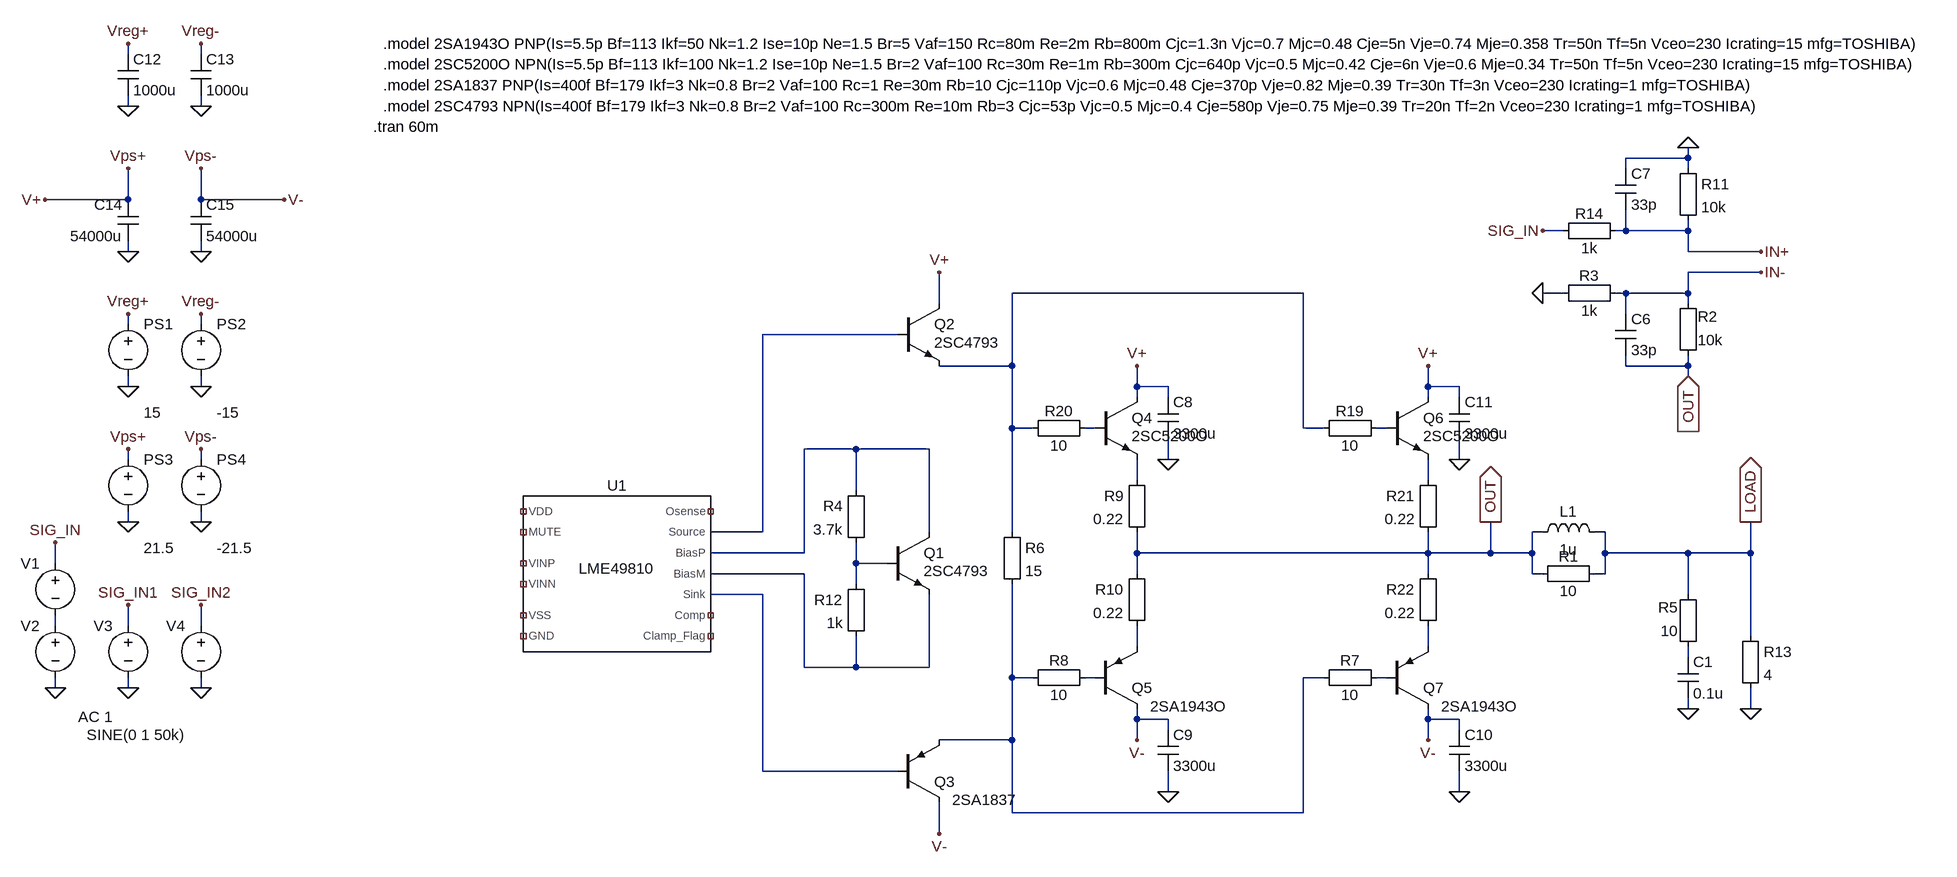
[diagram p0: schematic LME49810.asc]
LME49810.asc, the LTspice schematic file:
Version 4
SHEET 1 5860 2324
WIRE -1152 -3136 -1152 -3152
WIRE -1040 -3136 -1040 -3152
WIRE -1152 -3056 -1152 -3072
WIRE -1040 -3056 -1040 -3072
WIRE 1248 -2976 1248 -2992
WIRE 1248 -2976 1152 -2976
WIRE 1152 -2960 1152 -2976
WIRE 1248 -2960 1248 -2976
WIRE -1152 -2912 -1152 -2960
WIRE -1152 -2912 -1280 -2912
WIRE -1040 -2912 -1040 -2960
WIRE -912 -2912 -1040 -2912
WIRE 1056 -2864 1024 -2864
WIRE 1152 -2864 1152 -2896
WIRE 1152 -2864 1136 -2864
WIRE 1248 -2864 1248 -2880
WIRE 1248 -2864 1152 -2864
WIRE -1152 -2832 -1152 -2848
WIRE -1040 -2832 -1040 -2848
WIRE 1248 -2832 1248 -2864
WIRE 1360 -2832 1248 -2832
WIRE 1360 -2800 1248 -2800
WIRE 656 -2768 208 -2768
WIRE 1056 -2768 1024 -2768
WIRE 1152 -2768 1136 -2768
WIRE 1248 -2768 1248 -2800
WIRE 1248 -2768 1152 -2768
WIRE 96 -2752 96 -2800
WIRE 1248 -2752 1248 -2768
WIRE 1152 -2736 1152 -2768
WIRE -1152 -2720 -1152 -2736
WIRE -1040 -2720 -1040 -2736
WIRE 32 -2704 -176 -2704
WIRE 208 -2656 208 -2768
WIRE 208 -2656 96 -2656
WIRE 1152 -2656 1152 -2672
WIRE 1248 -2656 1248 -2672
WIRE 1248 -2656 1152 -2656
WIRE 1248 -2640 1248 -2656
WIRE -1152 -2624 -1152 -2640
WIRE -1040 -2624 -1040 -2640
WIRE 400 -2624 400 -2656
WIRE 448 -2624 400 -2624
WIRE 848 -2624 848 -2656
WIRE 896 -2624 848 -2624
WIRE 400 -2608 400 -2624
WIRE 448 -2608 448 -2624
WIRE 848 -2608 848 -2624
WIRE 896 -2608 896 -2624
WIRE 208 -2560 208 -2656
WIRE 240 -2560 208 -2560
WIRE 336 -2560 320 -2560
WIRE 656 -2560 656 -2768
WIRE 688 -2560 656 -2560
WIRE 784 -2560 768 -2560
WIRE -32 -2528 -112 -2528
WIRE 80 -2528 -32 -2528
WIRE -1152 -2512 -1152 -2528
WIRE -1040 -2512 -1040 -2528
WIRE 448 -2512 448 -2544
WIRE 896 -2512 896 -2544
WIRE 400 -2480 400 -2512
WIRE 848 -2480 848 -2512
WIRE -32 -2464 -32 -2528
WIRE -1152 -2416 -1152 -2432
WIRE -1040 -2416 -1040 -2432
WIRE -176 -2400 -176 -2704
WIRE -176 -2400 -256 -2400
WIRE 80 -2400 80 -2528
WIRE 208 -2400 208 -2560
WIRE 1024 -2400 1008 -2400
WIRE 1120 -2400 1104 -2400
WIRE -112 -2368 -112 -2528
WIRE -112 -2368 -256 -2368
WIRE 400 -2368 400 -2400
WIRE 848 -2368 848 -2400
WIRE 848 -2368 400 -2368
WIRE 944 -2368 944 -2416
WIRE 944 -2368 848 -2368
WIRE 1008 -2368 1008 -2400
WIRE 1008 -2368 944 -2368
WIRE 1120 -2368 1120 -2400
WIRE 1248 -2368 1120 -2368
WIRE 1344 -2368 1344 -2416
WIRE 1344 -2368 1248 -2368
WIRE -1264 -2352 -1264 -2384
WIRE -32 -2352 -32 -2384
WIRE 16 -2352 -32 -2352
WIRE -112 -2336 -256 -2336
WIRE 400 -2336 400 -2368
WIRE 848 -2336 848 -2368
WIRE 1008 -2336 1008 -2368
WIRE 1024 -2336 1008 -2336
WIRE 1120 -2336 1120 -2368
WIRE 1120 -2336 1104 -2336
WIRE -32 -2320 -32 -2352
WIRE -176 -2304 -256 -2304
WIRE 1248 -2304 1248 -2368
WIRE -1264 -2256 -1264 -2272
WIRE -1152 -2256 -1152 -2288
WIRE -1040 -2256 -1040 -2288
WIRE 1344 -2240 1344 -2368
WIRE 400 -2224 400 -2256
WIRE 848 -2224 848 -2256
WIRE 1248 -2208 1248 -2224
WIRE -112 -2192 -112 -2336
WIRE -32 -2192 -32 -2240
WIRE -32 -2192 -112 -2192
WIRE 80 -2192 80 -2304
WIRE 80 -2192 -32 -2192
WIRE 208 -2176 208 -2320
WIRE 240 -2176 208 -2176
WIRE 336 -2176 320 -2176
WIRE 688 -2176 656 -2176
WIRE 784 -2176 768 -2176
WIRE -1264 -2160 -1264 -2176
WIRE -1152 -2160 -1152 -2176
WIRE -1040 -2160 -1040 -2176
WIRE 1248 -2128 1248 -2144
WIRE 1344 -2128 1344 -2160
WIRE 400 -2112 400 -2128
WIRE 448 -2112 400 -2112
WIRE 848 -2112 848 -2128
WIRE 896 -2112 848 -2112
WIRE 448 -2096 448 -2112
WIRE 896 -2096 896 -2112
WIRE 208 -2080 208 -2176
WIRE 208 -2080 96 -2080
WIRE 400 -2080 400 -2112
WIRE 848 -2080 848 -2112
WIRE -176 -2032 -176 -2304
WIRE 32 -2032 -176 -2032
WIRE 448 -2000 448 -2032
WIRE 896 -2000 896 -2032
WIRE 208 -1968 208 -2080
WIRE 656 -1968 656 -2176
WIRE 656 -1968 208 -1968
WIRE 96 -1936 96 -1984
FLAG 96 -2800 V+
FLAG 96 -1936 V-
FLAG 400 -2656 V+
FLAG 400 -2080 V-
FLAG -1152 -2624 0
FLAG -1040 -2624 0
FLAG -1152 -2416 0
FLAG -1040 -2416 0
FLAG 848 -2656 V+
FLAG 848 -2080 V-
FLAG -1264 -2160 0
FLAG -1264 -2384 SIG_IN
FLAG -1152 -3152 Vreg+
FLAG -1040 -3152 Vreg-
FLAG -1152 -2736 Vreg+
FLAG -1040 -2736 Vreg-
FLAG -1152 -2528 Vps+
FLAG -1040 -2528 Vps-
FLAG -1152 -3056 0
FLAG -1040 -3056 0
FLAG -1152 -2832 0
FLAG -1040 -2832 0
FLAG 944 -2416 OUT
IOPIN 944 -2416 Out
FLAG -1152 -2160 0
FLAG -1152 -2288 SIG_IN1
FLAG -1040 -2160 0
FLAG -1040 -2288 SIG_IN2
FLAG 448 -2512 0
FLAG 448 -2000 0
FLAG 896 -2000 0
FLAG 896 -2512 0
FLAG -1152 -2960 Vps+
FLAG -1040 -2960 Vps-
FLAG -1280 -2912 V+
FLAG -912 -2912 V-
FLAG 1248 -2640 OUT
IOPIN 1248 -2640 In
FLAG 1024 -2768 0
FLAG 1248 -2992 0
FLAG 1024 -2864 SIG_IN
FLAG 1344 -2128 0
FLAG 1360 -2832 IN+
FLAG 1360 -2800 IN-
FLAG 1248 -2128 0
FLAG 1344 -2416 LOAD
IOPIN 1344 -2416 Out
SYMBOL npn 32 -2752 R0
WINDOW 3 56 60 Left 2
SYMATTR Value 2SC4793
SYMATTR InstName Q2
SYMBOL Misc\\EuropeanResistor -16 -2480 M0
SYMATTR InstName R4
SYMATTR Value 3.7k
SYMBOL Misc\\EuropeanResistor 192 -2416 R0
SYMATTR InstName R6
SYMATTR Value 15
SYMBOL Misc\\EuropeanResistor 416 -2496 M0
SYMATTR InstName R9
SYMATTR Value 0.22
SYMBOL Misc\\EuropeanResistor 416 -2352 M0
SYMATTR InstName R10
SYMATTR Value 0.22
SYMBOL pnp 32 -1984 M180
WINDOW 3 84 4 Left 2
SYMATTR Value 2SA1837
SYMATTR InstName Q3
SYMBOL npn 336 -2608 R0
WINDOW 3 56 60 Left 2
SYMATTR Value 2SC5200O
SYMATTR InstName Q4
SYMBOL pnp 336 -2128 M180
WINDOW 3 84 4 Left 2
SYMATTR Value 2SA1943O
SYMATTR InstName Q5
SYMBOL voltage -1152 -2736 R0
WINDOW 123 24 124 Left 2
WINDOW 39 24 180 Left 2
WINDOW 3 24 152 Left 2
SYMATTR Value 15
SYMATTR InstName PS1
SYMBOL voltage -1040 -2736 R0
WINDOW 123 24 124 Left 2
WINDOW 39 24 180 Left 2
WINDOW 3 24 152 Left 2
SYMATTR Value -15
SYMATTR InstName PS2
SYMBOL voltage -1152 -2528 R0
WINDOW 123 24 124 Left 2
WINDOW 39 24 180 Left 2
WINDOW 3 24 152 Left 2
SYMATTR Value 21.5
SYMATTR InstName PS3
SYMBOL voltage -1040 -2528 R0
WINDOW 123 24 124 Left 2
WINDOW 39 24 180 Left 2
WINDOW 3 24 152 Left 2
SYMATTR Value -21.5
SYMATTR InstName PS4
SYMBOL Misc\\EuropeanResistor 864 -2496 M0
SYMATTR InstName R21
SYMATTR Value 0.22
SYMBOL Misc\\EuropeanResistor 864 -2352 M0
SYMATTR InstName R22
SYMATTR Value 0.22
SYMBOL npn 784 -2608 R0
WINDOW 3 56 60 Left 2
SYMATTR Value 2SC5200O
SYMATTR InstName Q6
SYMBOL pnp 784 -2128 M180
WINDOW 3 84 4 Left 2
SYMATTR Value 2SA1943O
SYMATTR InstName Q7
SYMBOL voltage -1264 -2368 M0
WINDOW 39 0 0 Left 2
WINDOW 3 24 184 Invisible 2
WINDOW 123 0 0 Left 2
SYMATTR Value PULSE(-1 1 50m 0.0000001 0.0000001 0.0000049 0.00001)
SYMATTR InstName V1
SYMBOL voltage -1264 -2272 M0
WINDOW 3 24 184 Invisible 2
WINDOW 123 0 0 Left 2
WINDOW 39 0 0 Left 2
SYMATTR Value PULSE(1 0 50m 0.0000001)
SYMATTR InstName V2
SYMBOL cap -1168 -3136 R0
SYMATTR InstName C12
SYMATTR Value 1000u
SYMBOL cap -1056 -3136 R0
SYMATTR InstName C13
SYMATTR Value 1000u
SYMBOL cap -1136 -2912 M0
SYMATTR InstName C14
SYMATTR Value 54000u
SYMBOL cap -1056 -2912 R0
SYMATTR InstName C15
SYMATTR Value 54000u
SYMBOL Misc\\EuropeanResistor 672 -2544 R270
WINDOW 0 27 56 VTop 2
WINDOW 3 5 56 VBottom 2
SYMATTR InstName R19
SYMATTR Value 10
SYMBOL voltage -1152 -2272 M0
WINDOW 123 24 156 Left 2
WINDOW 39 0 0 Left 2
WINDOW 3 24 184 Left 2
SYMATTR Value2 AC 1
SYMATTR Value ""
SYMATTR InstName V3
SYMBOL voltage -1040 -2272 M0
WINDOW 123 24 156 Left 2
WINDOW 39 0 0 Left 2
WINDOW 3 24 184 Left 2
SYMATTR Value SINE(0 1 50k)
SYMATTR InstName V4
SYMBOL cap 432 -2608 R0
SYMATTR InstName C8
SYMATTR Value 3300u
SYMBOL cap 432 -2096 R0
SYMATTR InstName C9
SYMATTR Value 3300u
SYMBOL cap 880 -2096 R0
SYMATTR InstName C10
SYMATTR Value 3300u
SYMBOL cap 880 -2608 R0
SYMATTR InstName C11
SYMATTR Value 3300u
SYMBOL Misc\\EuropeanResistor 1232 -2656 M180
WINDOW 0 31 76 Left 2
WINDOW 3 31 40 Left 2
SYMATTR InstName R2
SYMATTR Value 10k
SYMBOL Misc\\EuropeanResistor 1152 -2752 M270
WINDOW 0 27 56 VTop 2
WINDOW 3 5 56 VBottom 2
SYMATTR InstName R3
SYMATTR Value 1k
SYMBOL Misc\\EuropeanResistor 1232 -2976 R0
SYMATTR InstName R11
SYMATTR Value 10k
SYMBOL Misc\\EuropeanResistor 1152 -2880 R90
WINDOW 0 5 56 VBottom 2
WINDOW 3 27 56 VTop 2
SYMATTR InstName R14
SYMATTR Value 1k
SYMBOL Misc\\EuropeanResistor 672 -2160 R270
WINDOW 0 27 56 VTop 2
WINDOW 3 5 56 VBottom 2
SYMATTR InstName R7
SYMATTR Value 10
SYMBOL Misc\\EuropeanResistor 224 -2160 R270
WINDOW 0 27 56 VTop 2
WINDOW 3 5 56 VBottom 2
SYMATTR InstName R8
SYMATTR Value 10
SYMBOL Misc\\EuropeanResistor 224 -2544 R270
WINDOW 0 27 56 VTop 2
WINDOW 3 5 56 VBottom 2
SYMATTR InstName R20
SYMATTR Value 10
SYMBOL npn 16 -2400 R0
WINDOW 3 56 60 Left 2
SYMATTR Value 2SC4793
SYMATTR InstName Q1
SYMBOL Misc\\EuropeanResistor -16 -2336 M0
SYMATTR InstName R12
SYMATTR Value 1k
SYMBOL Misc\\EuropeanResistor 1328 -2256 R0
SYMATTR InstName R13
SYMATTR Value 4
SYMBOL cap 1136 -2736 R0
SYMATTR InstName C6
SYMATTR Value 33p
SYMBOL cap 1136 -2960 R0
SYMATTR InstName C7
SYMATTR Value 33p
SYMBOL ind 1008 -2384 R270
WINDOW 0 32 56 VTop 2
WINDOW 3 5 56 VBottom 2
SYMATTR InstName L1
SYMATTR Value 1u
SYMBOL Misc\\EuropeanResistor 1120 -2352 R90
WINDOW 0 5 56 VBottom 2
WINDOW 3 27 56 VTop 2
SYMATTR InstName R1
SYMATTR Value 10
SYMBOL cap 1232 -2208 R0
SYMATTR InstName C1
SYMATTR Value 0.1u
SYMBOL Misc\\EuropeanResistor 1264 -2208 R180
WINDOW 0 31 76 Left 2
WINDOW 3 31 40 Left 2
SYMATTR InstName R5
SYMATTR Value 10
SYMBOL LME49810 -400 -2336 R0
SYMATTR InstName U1
TEXT -672 -3024 Right 2 !.tran 60m
TEXT -760 -3152 Left 2 !.model 2SA1943O PNP(Is=5.5p Bf=113 Ikf=50 Nk=1.2 Ise=10p Ne=1.5 Br=5 Vaf=150 Rc=80m Re=2m Rb=800m Cjc=1.3n Vjc=0.7 Mjc=0.48 Cje=5n Vje=0.74 Mje=0.358 Tr=50n Tf=5n Vceo=230 Icrating=15 mfg=TOSHIBA)
TEXT -760 -3120 Left 2 !.model 2SC5200O NPN(Is=5.5p Bf=113 Ikf=100 Nk=1.2 Ise=10p Ne=1.5 Br=2 Vaf=100 Rc=30m Re=1m Rb=300m Cjc=640p Vjc=0.5 Mjc=0.42 Cje=6n Vje=0.6 Mje=0.34 Tr=50n Tf=5n Vceo=230 Icrating=15 mfg=TOSHIBA)
TEXT -760 -3088 Left 2 !.model 2SA1837 PNP(Is=400f Bf=179 Ikf=3 Nk=0.8 Br=2 Vaf=100 Rc=1 Re=30m Rb=10 Cjc=110p Vjc=0.6 Mjc=0.48 Cje=370p Vje=0.82 Mje=0.39 Tr=30n Tf=3n Vceo=230 Icrating=1 mfg=TOSHIBA)
TEXT -760 -3056 Left 2 !.model 2SC4793 NPN(Is=400f Bf=179 Ikf=3 Nk=0.8 Br=2 Vaf=100 Rc=300m Re=10m Rb=3 Cjc=53p Vjc=0.5 Mjc=0.4 Cje=580p Vje=0.75 Mje=0.39 Tr=20n Tf=2n Vceo=230 Icrating=1 mfg=TOSHIBA)

The netlist it stands for:
* LME49810.asc
Q2 Vps+ N002 N001 0 2SC4793
R4 N005 N008 3.7k
R6 N001 N015 15
R9 N006 OUT 0.22
R10 OUT N012 0.22
Q3 Vps- N010 N015 0 2SA1837
Q4 Vps+ N003 N006 0 2SC5200O
Q5 Vps- N016 N012 0 2SA1943O
V§PS1 Vreg+ 0 15
V§PS2 Vreg- 0 -15
V§PS3 Vps+ 0 21.5
V§PS4 Vps- 0 -21.5
R21 N007 OUT 0.22
R22 OUT N013 0.22
Q6 Vps+ N004 N007 0 2SC5200O
Q7 Vps- N017 N013 0 2SA1943O
V1 SIG_IN N011 PULSE(-1 1 50m 0.0000001 0.0000001 0.0000049 0.00001)
V2 N011 0 PULSE(1 0 50m 0.0000001)
C12 Vreg+ 0 1000u
C13 Vreg- 0 1000u
C14 Vps+ 0 54000u
C15 Vps- 0 54000u
R19 N001 N004 10
V3 SIG_IN1 0 AC 1
V4 SIG_IN2 0 SINE(0 1 50k)
C8 Vps+ 0 3300u
C9 Vps- 0 3300u
C10 Vps- 0 3300u
C11 Vps+ 0 3300u
R2 OUT IN- 10k
R3 IN- 0 1k
R11 0 IN+ 10k
R14 IN+ SIG_IN 1k
R7 N015 N017 10
R8 N015 N016 10
R20 N001 N003 10
Q1 N005 N008 N009 0 2SC4793
R12 N008 N009 1k
R13 LOAD 0 4
C6 IN- OUT 33p
C7 0 IN+ 33p
L1 OUT LOAD 1u
R1 LOAD OUT 10
C1 N014 0 0.1u
R5 N014 LOAD 10
XU1 NC_01 NC_02 NC_03 NC_04 NC_05 NC_06 NC_07 NC_08 N002 NC_09 N009 N005 N010 LME49810  ; pins VSS Osense Clamp_Flag VDD VINN VINP Comp GND Source MUTE BiasM BiasP Sink
.model NPN NPN
.model PNP PNP
.lib standard.bjt
.tran 60m
.model 2SA1943O PNP(Is=5.5p Bf=113 Ikf=50 Nk=1.2 Ise=10p Ne=1.5 Br=5 Vaf=150 Rc=80m Re=2m Rb=800m Cjc=1.3n Vjc=0.7 Mjc=0.48 Cje=5n Vje=0.74 Mje=0.358 Tr=50n Tf=5n Vceo=230 Icrating=15 mfg=TOSHIBA)
.model 2SC5200O NPN(Is=5.5p Bf=113 Ikf=100 Nk=1.2 Ise=10p Ne=1.5 Br=2 Vaf=100 Rc=30m Re=1m Rb=300m Cjc=640p Vjc=0.5 Mjc=0.42 Cje=6n Vje=0.6 Mje=0.34 Tr=50n Tf=5n Vceo=230 Icrating=15 mfg=TOSHIBA)
.model 2SA1837 PNP(Is=400f Bf=179 Ikf=3 Nk=0.8 Br=2 Vaf=100 Rc=1 Re=30m Rb=10 Cjc=110p Vjc=0.6 Mjc=0.48 Cje=370p Vje=0.82 Mje=0.39 Tr=30n Tf=3n Vceo=230 Icrating=1 mfg=TOSHIBA)
.model 2SC4793 NPN(Is=400f Bf=179 Ikf=3 Nk=0.8 Br=2 Vaf=100 Rc=300m Re=10m Rb=3 Cjc=53p Vjc=0.5 Mjc=0.4 Cje=580p Vje=0.75 Mje=0.39 Tr=20n Tf=2n Vceo=230 Icrating=1 mfg=TOSHIBA)
.lib C:\Users\Tahiro\Dropbox\TDU_02\Audio\LTSpice\gakuhatsu2015\LME49810.lib
.backanno
.end